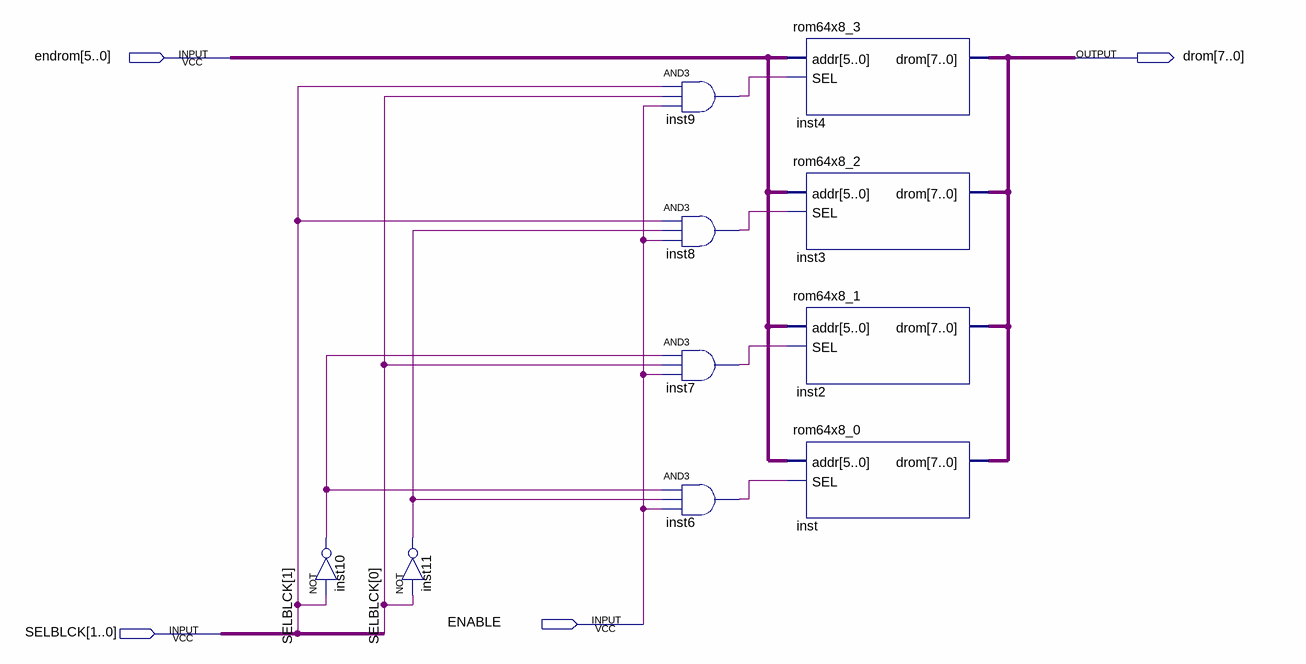
[diagram p0: schematic sheet]
// Quartus schematic memprog.bdf as structural Verilog: 10 symbols, 4 pins
module memprog (
  input  [5:0] endrom,
  input  ENABLE,
  input  [1:0] SELBLCK,
  output [7:0] drom
);

  wire inst6_out, inst7_out, inst8_out, inst9_out, inst10_out, inst11_out;

  not inst10 (inst10_out, SELBLCK[1]);
  not inst11 (inst11_out, SELBLCK[0]);
  and inst9 (inst9_out, SELBLCK[1], SELBLCK[0], ENABLE);
  and inst8 (inst8_out, SELBLCK[1], inst11_out, ENABLE);
  and inst7 (inst7_out, inst10_out, SELBLCK[0], ENABLE);
  and inst6 (inst6_out, inst10_out, inst11_out, ENABLE);
  rom64x8_3 inst4 (.addr(endrom), .SEL(inst9_out), .drom(drom));
  rom64x8_2 inst3 (.addr(endrom), .SEL(inst8_out), .drom(drom));
  rom64x8_1 inst2 (.addr(endrom), .SEL(inst7_out), .drom(drom));
  rom64x8_0 inst (.addr(endrom), .SEL(inst6_out), .drom(drom));
endmodule
